# Altium schematic sheet Fly-Back.SchDoc
size A4; DocumentNumber: 3; SheetNumber: 3; SheetTotal: 5
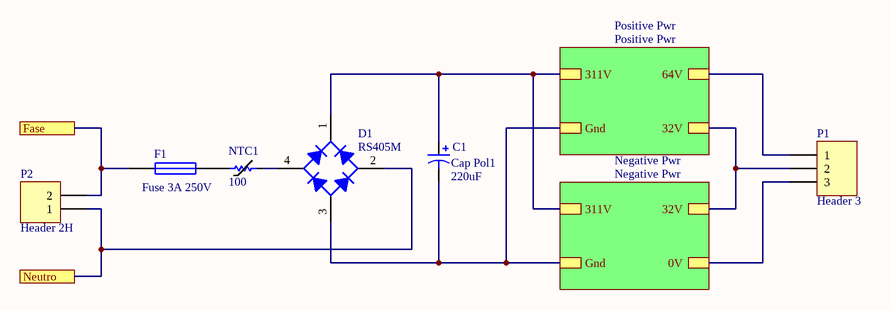
[diagram p0: Fly-Back.SchDoc]

## Parts
C1  Cap Pol1  value 220uF  [cap rad 100mm]
D1  RS405M  [RS405M]
F1  Fuse 3A 250V  [FUSE 3A]
NTC1  VALOR: 100  [RAD-0.3]  (hidden comment: Termistor NTC)
P1  Header 3  [bornera 3]
P2  Header 2H  [bornera 2]

## Sub-sheets
Negative Pwr = Negative Pwr: 311V, Gnd, 32V, 0V
Positive Pwr = Positive Pwr: 311V, Gnd, 64V, 32V

## Ports
Fase, Neutro

## Nets
Fase: F1.1 P2.2 ; port Fase
Neutro: D1.2(C) P2.1 ; port Neutro
NetC1_1: C1.1 D1.1(K) ; sheet Positive Pwr/311V, sheet Negative Pwr/311V
NetC1_2: C1.2 D1.3(A) ; sheet Positive Pwr/Gnd, sheet Negative Pwr/Gnd
NetD1_4: D1.4(C) NTC1.1
NetF1_2: F1.2 NTC1.2
NetP1_1: P1.1 ; sheet Positive Pwr/64V
NetP1_2: P1.2 ; sheet Positive Pwr/32V, sheet Negative Pwr/32V
NetP1_3: P1.3 ; sheet Negative Pwr/0V

## Library data of the parts
C1 = Cap Pol1: Polarized Capacitor (Radial); Published: 8-Jun-2000; LatestRevisionDate: 17-Jul-2002; LatestRevisionNote: Re-released for DXP Platform.; PackageReference: RB7.6-15; Publisher: Altium Limited; PackageDescription: Polarized Capacitor (Radial); 2 Leads
D1 = Bridge1: Full Wave Diode Bridge; Published: 8-Jun-2000; LatestRevisionDate: 29-May-2009; LatestRevisionNote: Sch pins A & K swapped.; DatasheetVersion: E2732B; PackageReference: D-38; Publisher: Altium Limited; PackageDescription: Bridge Rectifier; 4 Terminals; Body 9.4 x 9.4 mm (typ); Pitch 5.08 mm
F1 = Fuse 1: Fuse; Published: 8-Jun-2000; LatestRevisionDate: 17-Jul-2002; LatestRevisionNote: Re-released for DXP Platform.; PackageReference: PIN-W2/E2.8; Publisher: Altium Limited; PackageDescription: Thru-Hole; 2 Leads
NTC1 = Termistor NTC: Termistor NTC SMD; PROVEEDOR: *; CODIGO STI: *; FABRICANTE: *
P1 = Header 3: Header, 3-Pin; LatestRevisionDate: 17-Jul-2002; LatestRevisionNote: Re-released for DXP Platform.; Publisher: Altium Limited
P2 = Header 2H: Header, 2-Pin, Right Angle; LatestRevisionDate: 17-Jul-2002; LatestRevisionNote: Re-released for DXP Platform.; Publisher: Altium Limited